# EAGLE design XBee (EAGLE 6.2)
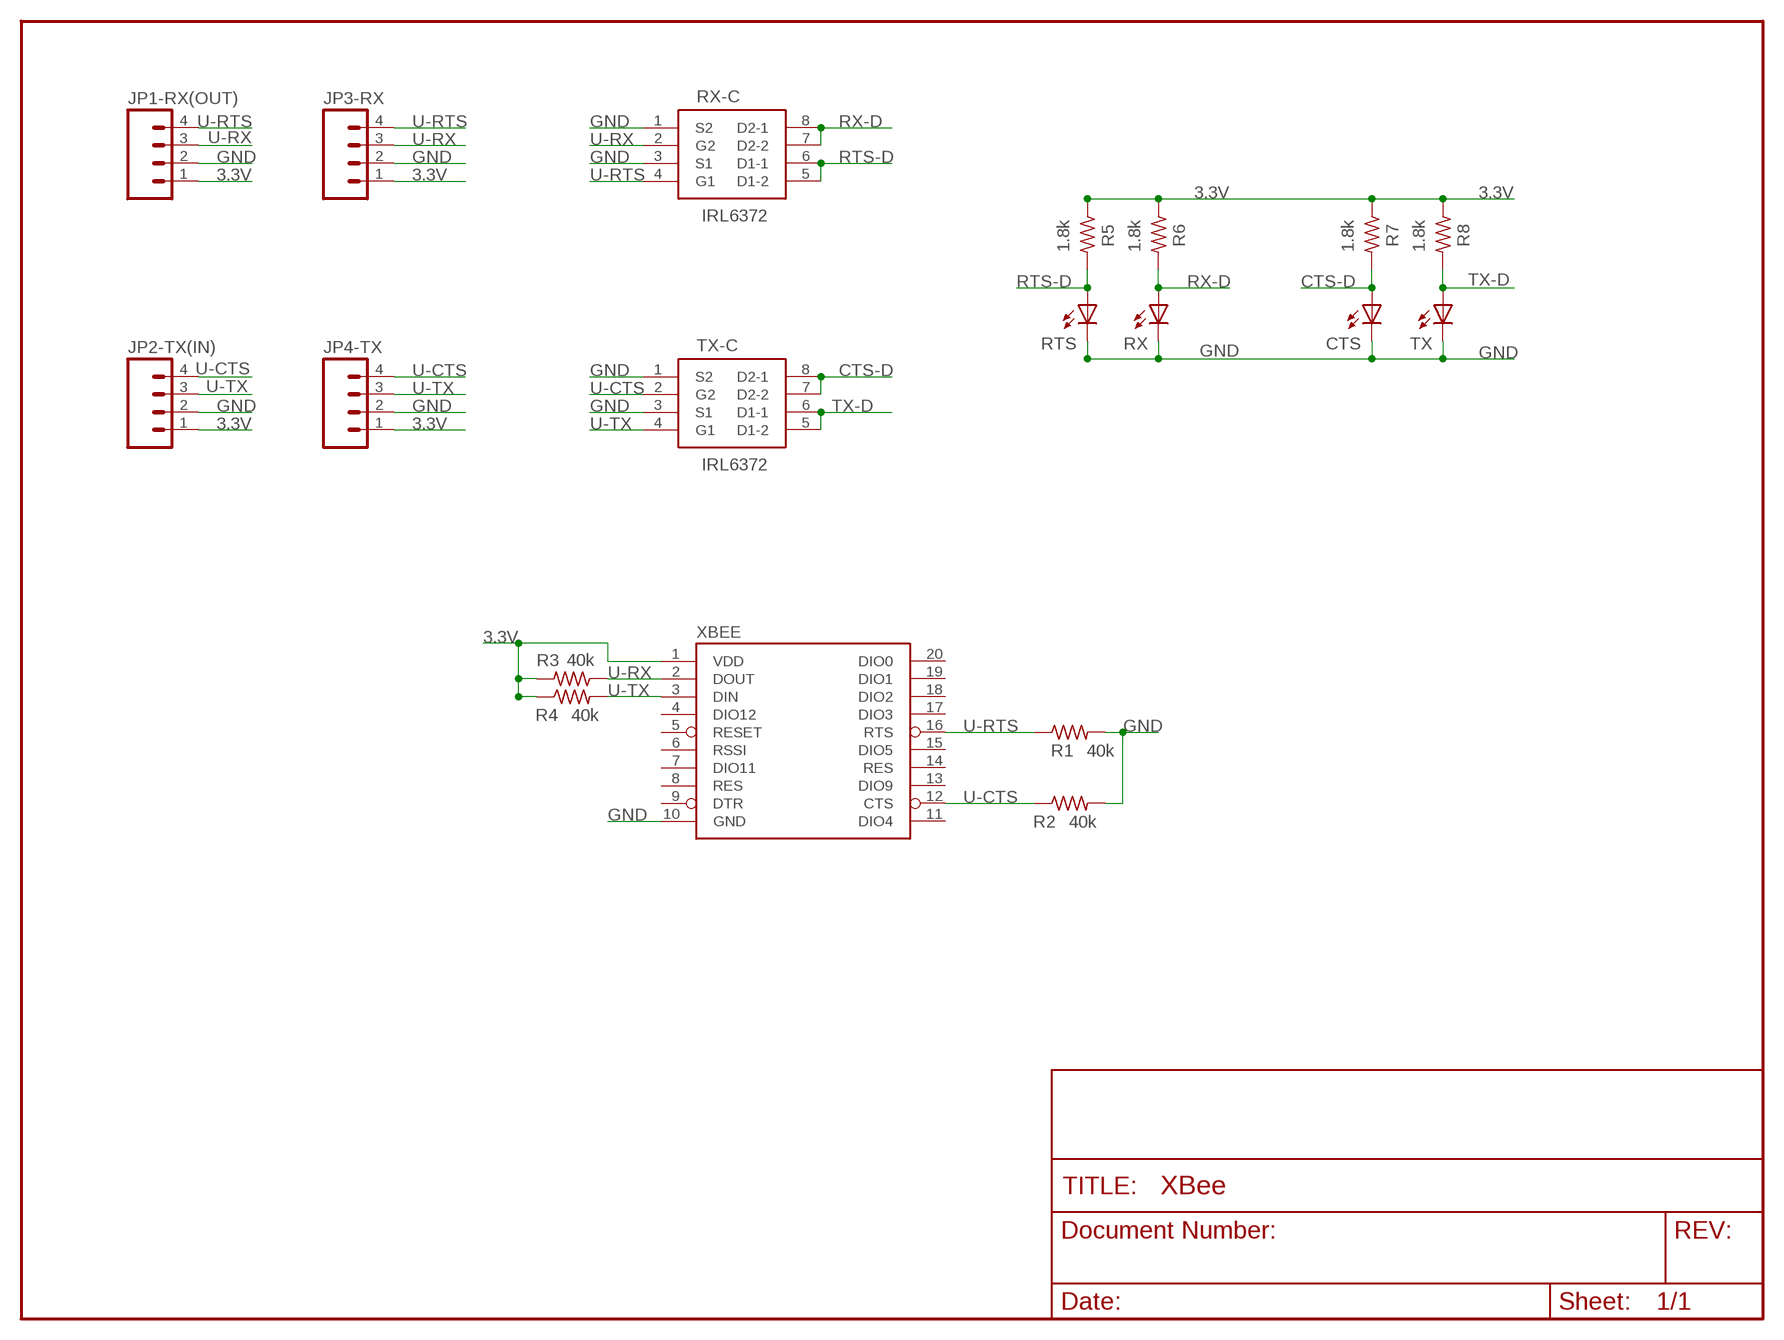
[diagram p0: schematic, sheet 1]

## Parts
CTS  LED3MM  [LED3MM]
JP1-RX(OUT)  M04LOCK_LONGPADS  [1X04_LOCK_LONGPADS]
JP2-TX(IN)  M04LOCK_LONGPADS  [1X04_LOCK_LONGPADS]
JP3-RX  M04LOCK_LONGPADS  [1X04_LOCK_LONGPADS]
JP4-TX  M04LOCK_LONGPADS  [1X04_LOCK_LONGPADS]
R1  40k  R-US_0204/7  [0204/7]
R2  40k  R-US_0204/7  [0204/7]
R3  40k  R-US_0204/7  [0204/7]
R4  40k  R-US_0204/7  [0204/7]
R5  1.8k  R-US_0204/7  [0204/7]
R6  1.8k  R-US_0204/7  [0204/7]
R7  1.8k  R-US_0204/7  [0204/7]
R8  1.8k  R-US_0204/7  [0204/7]
RTS  LED3MM  [LED3MM]
RX  LED3MM  [LED3MM]
RX-C  IRL6372  IRL6372_DUAL_MOSFET  [SO08-LARGE-PAD-AZ]
TX  LED3MM  [LED3MM]
TX-C  IRL6372  IRL6372_DUAL_MOSFET  [SO08-LARGE-PAD-AZ]
XBEE  XBEELOCK-SMALL-PRINT  [XBEE-1_LOCK]

## Nets
3.3V: JP1-RX(OUT).1 JP2-TX(IN).1 JP3-RX.1 JP4-TX.1 R3.2 R4.1 R5.1 R6.1 R7.1 R8.1 XBEE.1(VDD)
CTS-D: CTS.A R7.2 TX-C.7(D2-2) TX-C.8(D2-1)
GND: CTS.K(C) JP1-RX(OUT).2 JP2-TX(IN).2 JP3-RX.2 JP4-TX.2 R1.2 R2.2 RTS.K(C) RX-C.1(S2) RX-C.3(S1) RX.K(C) TX-C.1(S2) TX-C.3(S1) TX.K(C) XBEE.10(GND)
RTS-D: R5.2 RTS.A RX-C.5(D1-2) RX-C.6(D1-1)
RX-D: R6.2 RX-C.7(D2-2) RX-C.8(D2-1) RX.A
TX-D: R8.2 TX-C.5(D1-2) TX-C.6(D1-1) TX.A
U-CTS: JP2-TX(IN).4 JP4-TX.4 R2.1 TX-C.2(G2) XBEE.12(CTS)
U-RTS: JP1-RX(OUT).4 JP3-RX.4 R1.1 RX-C.4(G1) XBEE.16(RTS)
U-RX: JP1-RX(OUT).3 JP3-RX.3 R3.1 RX-C.2(G2) XBEE.2(DOUT)
U-TX: JP2-TX(IN).3 JP4-TX.3 R4.2 TX-C.4(G1) XBEE.3(DIN)
Unconnected: XBEE.4(DIO12) XBEE.5(RESET) XBEE.6(RSSI) XBEE.7(DIO11) XBEE.8(RES) XBEE.9(DTR) XBEE.11(DIO4) XBEE.13(DIO9) XBEE.14(RES) XBEE.15(DIO5) XBEE.17(DIO3) XBEE.18(DIO2) XBEE.19(DIO1) XBEE.20(DIO0)

## Library data of the parts
CTS RTS RX TX = SparkFun:LED: LEDs Standard schematic elements and footprints for 5mm, 3mm, 1206, and 0603 sized LEDs. 5mm - Spark Fun Electronics SKU : COM-00529 (and others)
JP1-RX(OUT) JP2-TX(IN) JP3-RX JP4-TX = SparkFun-Connectors:M04: Header 4 Standard 4-pin 0.1" header. Use with straight break away headers (SKU : PRT-00116), right angle break away headers (PRT-00553), swiss pins (PRT-00743), machine pins (PRT-00117), and female headers (PRT-00115). Molex polarized connector foot print use with SKU : PRT-08231 with associated crimp pins and housings. 1MM SMD Version SKU: PRT-10208
R1-R8 = resistor:R-US_: RESISTOR, American symbol
RX-C TX-C = AZ Custom:IRL6372_DUAL_MOSFET
XBEE = AZ Custom:XBEE

## Board
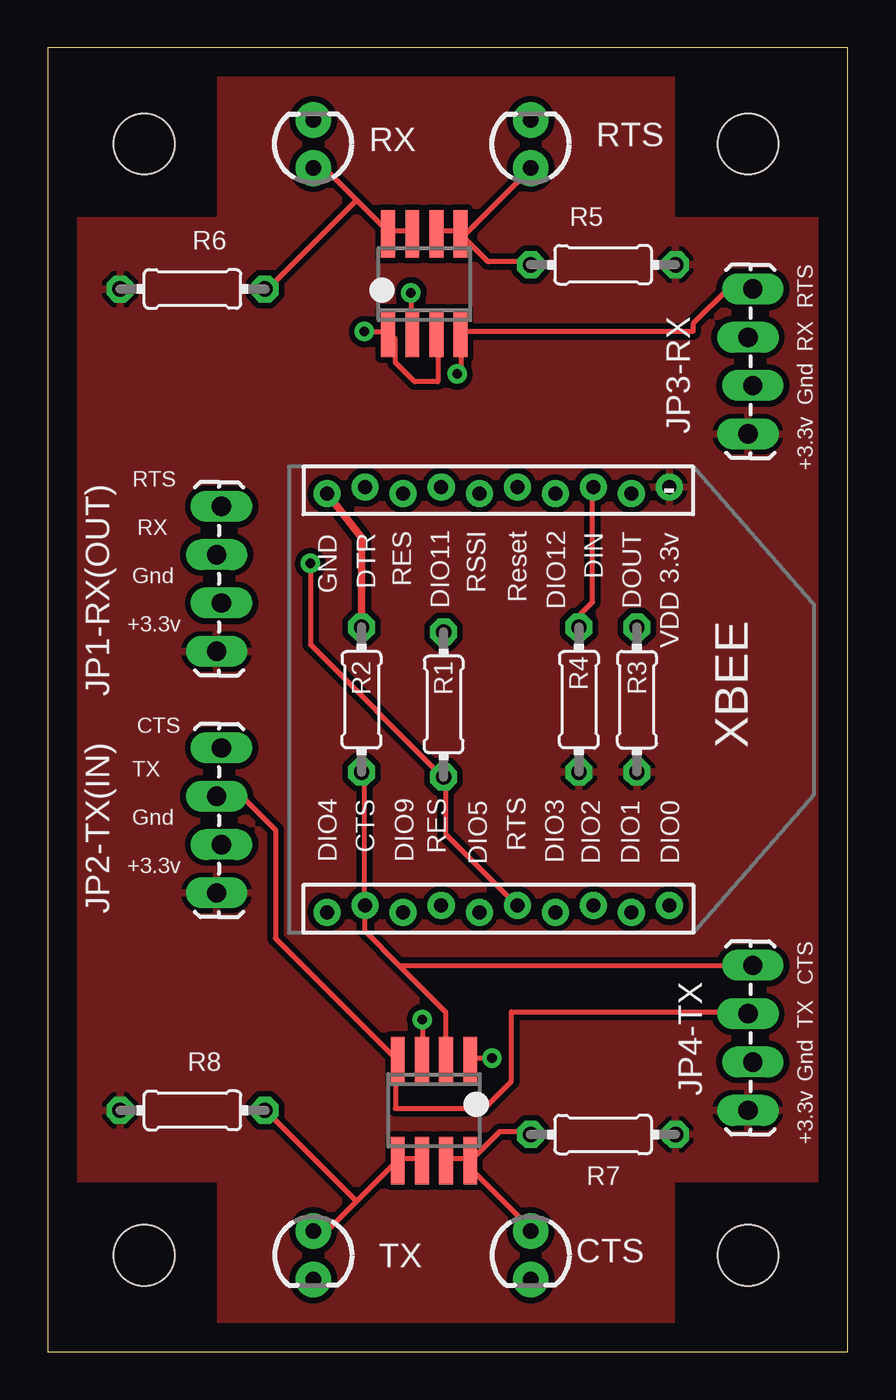
[diagram p1: board, top side]
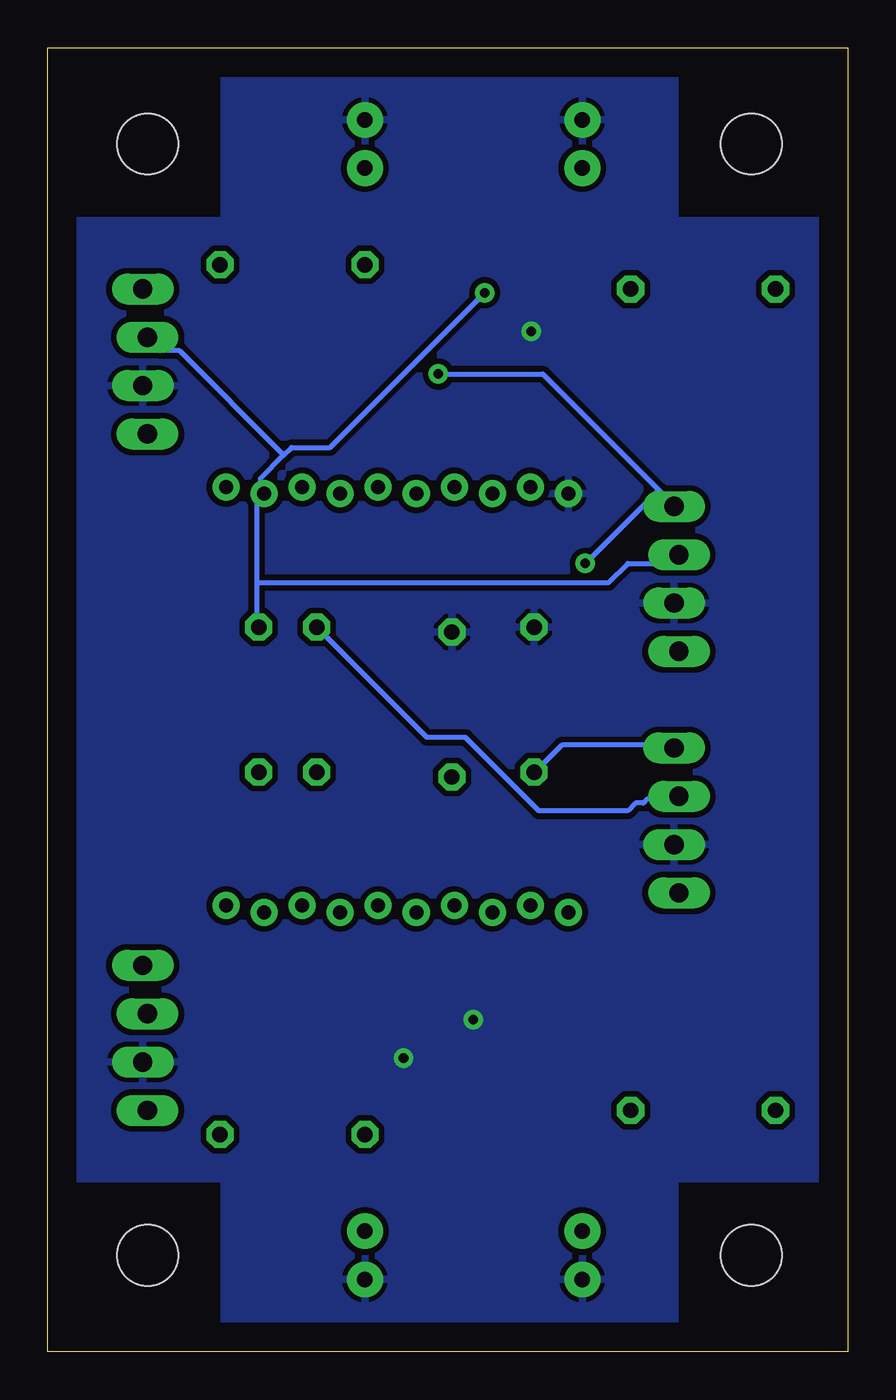
[diagram p2: board, bottom side, seen from below]

Size 42.09 x 68.57 mm. Coordinates in mm from the lower left corner, seen from the top.
Outline: 0,0 42.09,0 42.09,68.57 0,68.57 0,0
Copper layers (1*16): Top 0.035mm / dielectric 1.5mm / Bottom 0.035mm
Design rules: minimum track width 10mil, minimum drill 20mil, track to track 12mil, track to pad 12mil, pad to pad 12mil, via to via 8mil, smd to smd 8mil, copper to edge 60mil, drill to drill 20mil, minimum pad ring 12mil, minimum via ring 10mil, stop-mask expansion 4mil, vias tented up to drill 25mil, thermal gap 10mil
Holes 3.2 mm at 5.08,5.08 5.08,63.5 36.83,63.5 36.83,5.08
tRestrict: area 0,0 to 8.9,8.9; area 33,0 to 41.9,8.9; area 33,59.7 to 41.9,68.6; area 0,59.7 to 8.9,68.6
bRestrict: area 0,59.7 to 8.9,68.6; area 0,0 to 8.9,8.9; area 33,59.7 to 41.9,68.6; area 33,0 to 41.9,8.9; area 0,0 to 8.9,8.9

### Footprints (pad centres in the part's own frame; a part is rotated, then mirrored left to right if it is on the bottom)
LED3MM = drill 0.813 pad 1.88: A -1.27,0; K 1.27,0
1X04_LOCK_LONGPADS = drill 1.016 long: 1 0,0; 2 2.54,-0.254; 3 5.08,0; 4 7.62,-0.254
0204/7 = drill 0.813 octagon: 1 -3.81,0; 2 3.81,0
SO08-LARGE-PAD-AZ = smd 2.5 x 0.72: 1 -2.6,1.905; 2 -2.6,0.635; 3 -2.6,-0.635; 4 -2.6,-1.905; 5 2.65,-1.905; 6 2.65,-0.635; 7 2.65,0.635; 8 2.65,1.905
XBEE-1_LOCK = drill 0.737 pad 1.422: 1 -11.178,20; 2 -10.822,18; 3 -11.178,16; 4 -10.822,14; 5 -11.178,12; 6 -10.822,10; 7 -11.178,8; 8 -10.822,6; 9 -11.178,4; 10 -10.822,2; 11 11.178,2; 12 10.822,4; 13 11.178,6; 14 10.822,8; 15 11.178,10; 16 10.822,12; 17 11.178,14; 18 10.822,16; 19 11.178,18; 20 10.822,20

### Placement (x,y rotation side)
CTS  25.4,5.08 270 top
JP1-RX(OUT)  8.89,36.83 90 top
JP2-TX(IN)  8.89,24.13 90 top
JP3-RX  36.83,48.26 90 top
JP4-TX  36.83,12.7 90 top
R1  20.83,34.04 90 top
R2  16.51,34.29 90 top
R3  30.99,34.29 270 top
R4  27.94,34.29 90 top
R5  29.21,57.15 180 top
R6  7.62,55.88 0 top
R7  29.21,11.43 180 top
R8  7.62,12.7 0 top
RTS  25.4,63.5 90 top
RX  13.97,63.5 90 top
RX-C  19.81,56.13 90 top
TX  13.97,5.08 270 top
TX-C  20.32,12.7 270 top
XBEE  12.7,34.29 270 top

### Tracks (layer width: path | path; a pad name or v marks a point on that pad's centre or on a via)
3.3V
  pour Top: 0,68.58 41.91,68.58 41.91,0 0,0
CTS-D
  Top 0.254: TX-C.7 21.13,10.16 22.15,10.16 TX-C.8 | TX-C.8 22.35,10.16 23.77,11.58 25.4,11.58 R7.2 | CTS.A 25.4,6.5 22.35,9.55 22.35,9.96 TX-C.8
GND  (via drill 0.51)
  Top 0.254: v16.66,53.65 17.88,53.65 RX-C.1 18.09,53.44 18.29,53.24 18.29,52.02 19.3,51 20.52,51 20.52,53.44 RX-C.3 | v19.71,17.48 19.71,15.44 TX-C.3 | v23.37,15.44 22.35,15.44 TX-C.1
  Top 0.406: R2.2 16.51,42.8 XBEE.10
  pour Bottom: 0,68.58 41.91,68.58 41.91,0 0,0
RTS-D
  Top 0.254: RX-C.6 20.52,58.93 21.54,58.93 RX-C.5 | 21.95,58.52 23.16,57.3 25.4,57.3 R5.2 | 21.95,58.52 21.74,58.73 RX-C.5 | 21.95,58.52 21.95,58.73 25.4,62.18 RTS.A | 21.95,58.52 RX-C.5
RX-D
  Top 0.254: RX-C.7 19.1,58.93 18.09,58.93 RX-C.8 17.88,58.93 16.26,60.55 | 16.26,60.55 14.63,62.18 14.02,62.18 RX.A | 16.26,60.55 11.58,55.88 R6.2
TX-D
  Top 0.254: TX-C.6 19.51,10.16 18.49,10.16 TX-C.5 18.29,9.96 16.26,7.92 | 16.26,7.92 14.83,6.5 14.02,6.5 TX.A | 16.26,7.92 11.58,12.6 R8.2
U-CTS
  Top 0.254: 18.49,20.32 16.66,22.15 16.66,23.37 XBEE.12 16.66,23.57 16.66,30.48 R2.1 | 18.49,20.32 20.93,17.88 20.93,15.44 TX-C.2 | 18.49,20.32 JP4-TX.4
  Bottom 0.254: R2.1 16.46,30.48 15.04,31.9 9.14,31.9 JP2-TX(IN).4
U-RTS  (via drill 0.51)
  Top 0.254: XBEE.16 24.59,23.57 20.93,27.23 20.93,30.07 R1.1 20.73,30.28 13.82,37.19 v13.82,41.45 | JP3-RX.4 35.76,55.88 33.93,54.05 33.93,53.65 21.74,53.65 RX-C.4 21.74,53.44 21.74,51.61 v21.54,51.41
  Bottom 0.254: 9.96,45.31 16.05,51.41 v21.54,51.41 | 9.96,45.31 9.14,44.5 JP1-RX(OUT).4 9.96,45.31 | 9.96,45.31 v13.82,41.45
U-RX  (via drill 0.51)
  Top 0.254: v19.1,55.68 19.1,53.65 RX-C.2
  Bottom 0.254: v19.1,55.68 27.23,47.55 29.26,47.55 29.67,47.14 | 29.67,47.14 30.89,45.92 30.89,45.31 XBEE.2 30.89,45.11 31.09,45.11 31.09,40.44 | 31.09,40.44 31.09,38.2 R3.1 | JP1-RX(OUT).3 9.35,41.45 11.58,41.45 12.6,40.44 31.09,40.44 | 29.67,47.14 35.15,52.63 36.17,52.63 36.78,53.24 JP3-RX.3
U-TX
  Top 0.254: XBEE.3 28.65,45.31 28.65,39.42 28.04,38.81 28.04,38.2 R4.2 | JP2-TX(IN).3 8.94,29.06 10.36,29.06 11.99,27.43 11.99,21.74 18.29,15.44 TX-C.4 18.29,15.24 18.29,12.8 22.96,12.8 24.38,14.22 24.38,17.88 36.78,17.88 JP4-TX.3
  Bottom 0.254: R4.2 22.15,32.31 20.12,32.31 16.26,28.45 11.58,28.45 11.18,28.85 10.77,28.85 10.57,29.06 8.94,29.06 JP2-TX(IN).3

### Text on the board
tPlace: RTS | RX | Gnd | +3.3v | RTS | RX | Gnd | +3.3v | CTS | TX | Gnd | +3.3v | CTS | TX | Gnd | +3.3v